# Altium schematic sheet Interface.SchDoc
size A4
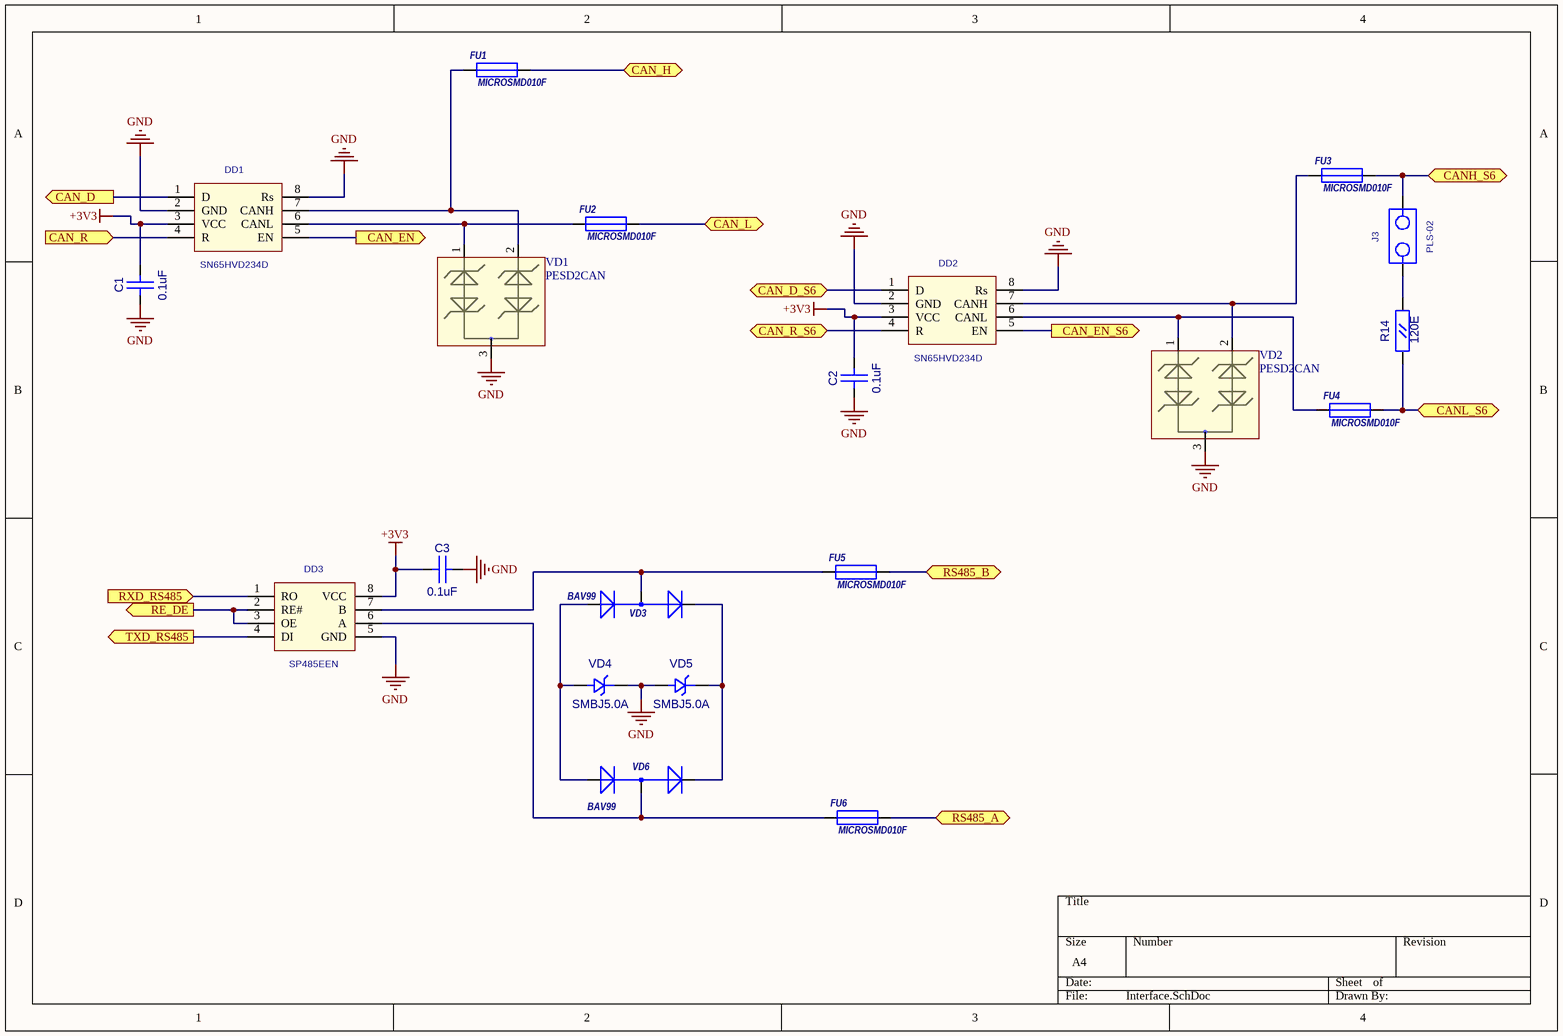
[diagram p0: Interface.SchDoc]

## Parts
C1  0.1uF  [CC0603]
C2  0.1uF  [CC0603]
C3  0.1uF  [CC0603]
DD1  SN65HVD234D  [SO-8]
DD2  SN65HVD234D  [SO-8]
DD3  SP485EEN  [SO-8]
FU1  MICROSMD010F  [RC1210]
FU2  MICROSMD010F  [RC1210]
FU3  MICROSMD010F  [RC1210]
FU4  MICROSMD010F  [RC1210]
FU5  MICROSMD010F  [RC1210]
FU6  MICROSMD010F  [RC1210]
J3  PLS-02  [PLS-02]
R14  120E  [RC0805]
VD1  PESD2CAN  [SOT-23(123)]
VD2  PESD2CAN  [SOT-23(123)]
VD3  BAV99  [SOT-23(GSD)]
VD4  SMBJ5.0A  [SMB]
VD5  SMBJ5.0A  [SMB]
VD6  BAV99  [SOT-23(GSD)]

## Ports
CAN_D (out), CAN_D_S6, CAN_EN (out), CAN_EN_S6 (out), CAN_H, CAN_L, CAN_R (in), CAN_R_S6, CANH_S6 (bidir), CANL_S6 (bidir), RE_DE (out), RS485_A, RS485_B, RXD_RS485 (in), TXD_RS485 (out)

## Nets
+3V3: C1.2(B) C2.2(B) C3.1(A) DD1.3(VCC) DD2.3(VCC) DD3.8(VCC)
GND: C1.1(A) C2.1(A) C3.2(B) DD1.2(GND) DD1.8(Rs) DD2.2(GND) DD2.8(Rs) DD3.5(GND) VD1.3 VD2.3 VD4.2(K) VD5.1(A)
CAN_D: DD1.1(D) ; port CAN_D
CAN_D_S6: DD2.1(D) ; port CAN_D_S6
CAN_EN: DD1.5(EN) ; port CAN_EN
CAN_EN_S6: DD2.5(EN) ; port CAN_EN_S6
CAN_H: FU1.2 ; port CAN_H
CAN_L: FU2.2 ; port CAN_L
CAN_R: DD1.4(R) ; port CAN_R
CAN_R_S6: DD2.4(R) ; port CAN_R_S6
CANH_S6: FU3.2 J3.2 ; port CANH_S6
CANL_S6: FU4.2 R14.1(A) ; port CANL_S6
RE_DE: DD3.2(RE#) DD3.3(OE) ; port RE_DE
RS485_A: FU6.2 ; port RS485_A
RS485_B: FU5.2 ; port RS485_B
RXD_RS485: DD3.1(RO) ; port RXD_RS485
TXD_RS485: DD3.4(DI) ; port TXD_RS485
NetDD1_6: DD1.6(CANL) FU2.1 VD1.1
NetDD1_7: DD1.7(CANH) FU1.1 VD1.2
NetDD2_6: DD2.6(CANL) FU4.1 VD2.1
NetDD2_7: DD2.7(CANH) FU3.1 VD2.2
NetDD3_6: DD3.6(A) FU6.1 VD6.3(AK)
NetDD3_7: DD3.7(B) FU5.1 VD3.3(AK)
NetJ3_1: J3.1 R14.2(B)
NetVD3_1: VD3.1(A) VD4.1(A) VD6.1(A)
NetVD3_2: VD3.2(K) VD5.2(K) VD6.2(K)

## Library data of the parts
C1-C3 = CC0603: Value: 0.1uF
DD1 DD2 = SN65HVD234D: CAN Transceiver; Value: *
DD3 = SP485: Value: *
FU1-FU6 = MICROSMD: Value: MICROSMD010F
R14 = RC0805: Value: 120E
VD1 VD2 = PESD2CAN: TVS for CAN
VD3 VD6 = BAV99: 1.0 Ampere General Purpose Rectifier; ComponentField6: Published 8-Jun-2000, Modified 11-July-2000: SIM Model Added.; Value: *
VD4 VD5 = SMBJ: Value: SMBJ5.0A
J3 = PLS-02: Value: *